# EAGLE board Beilage (EAGLE 9.6.2)
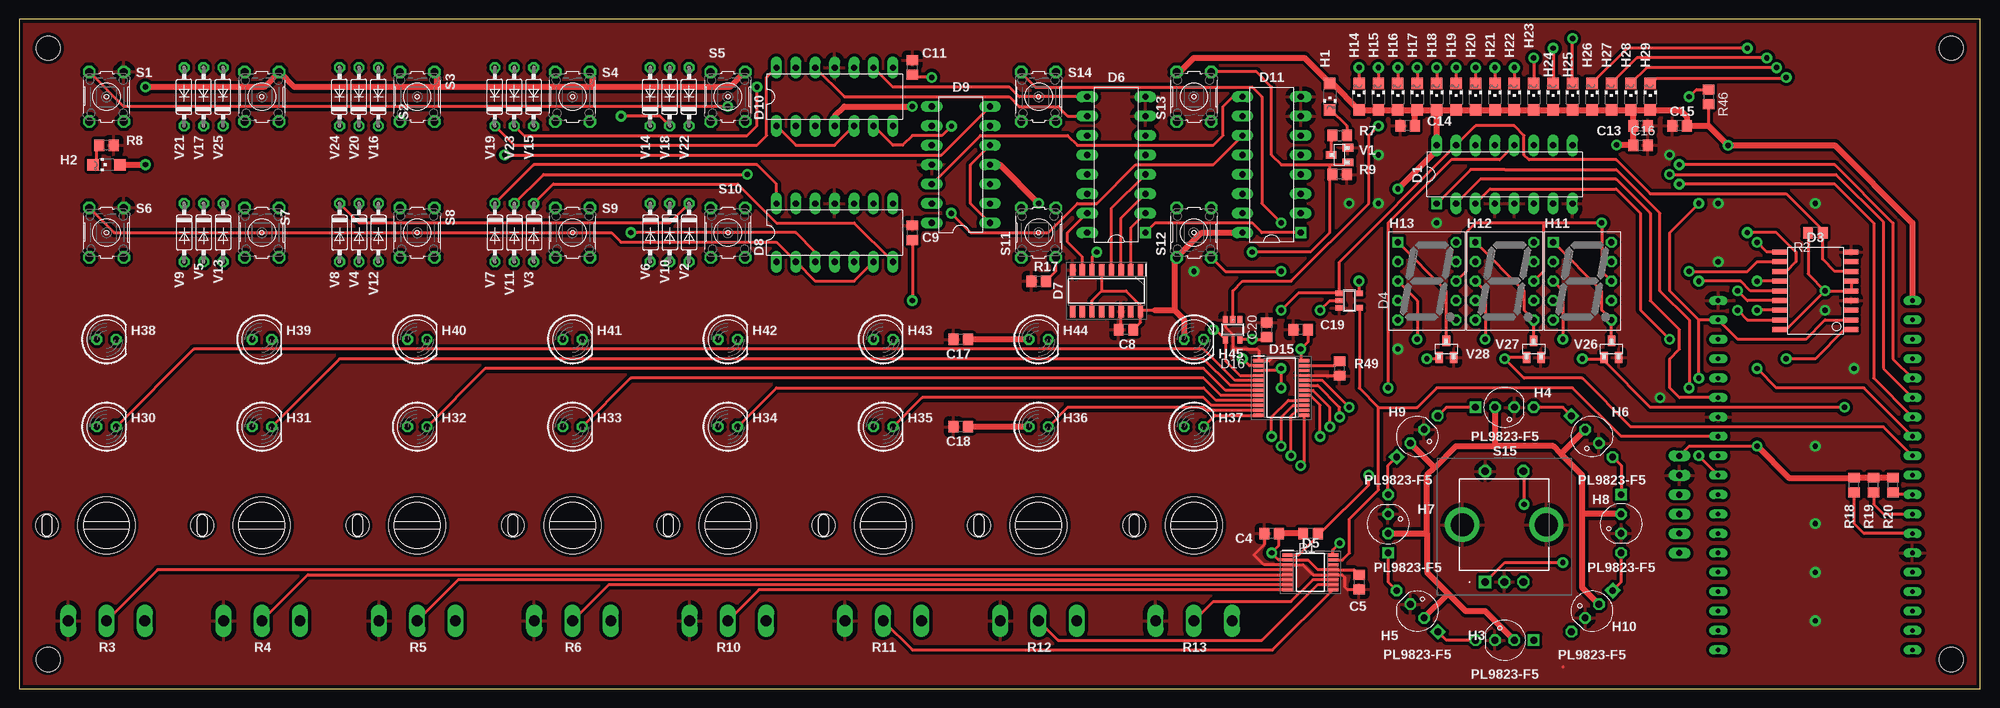
[diagram p5: board, top side]
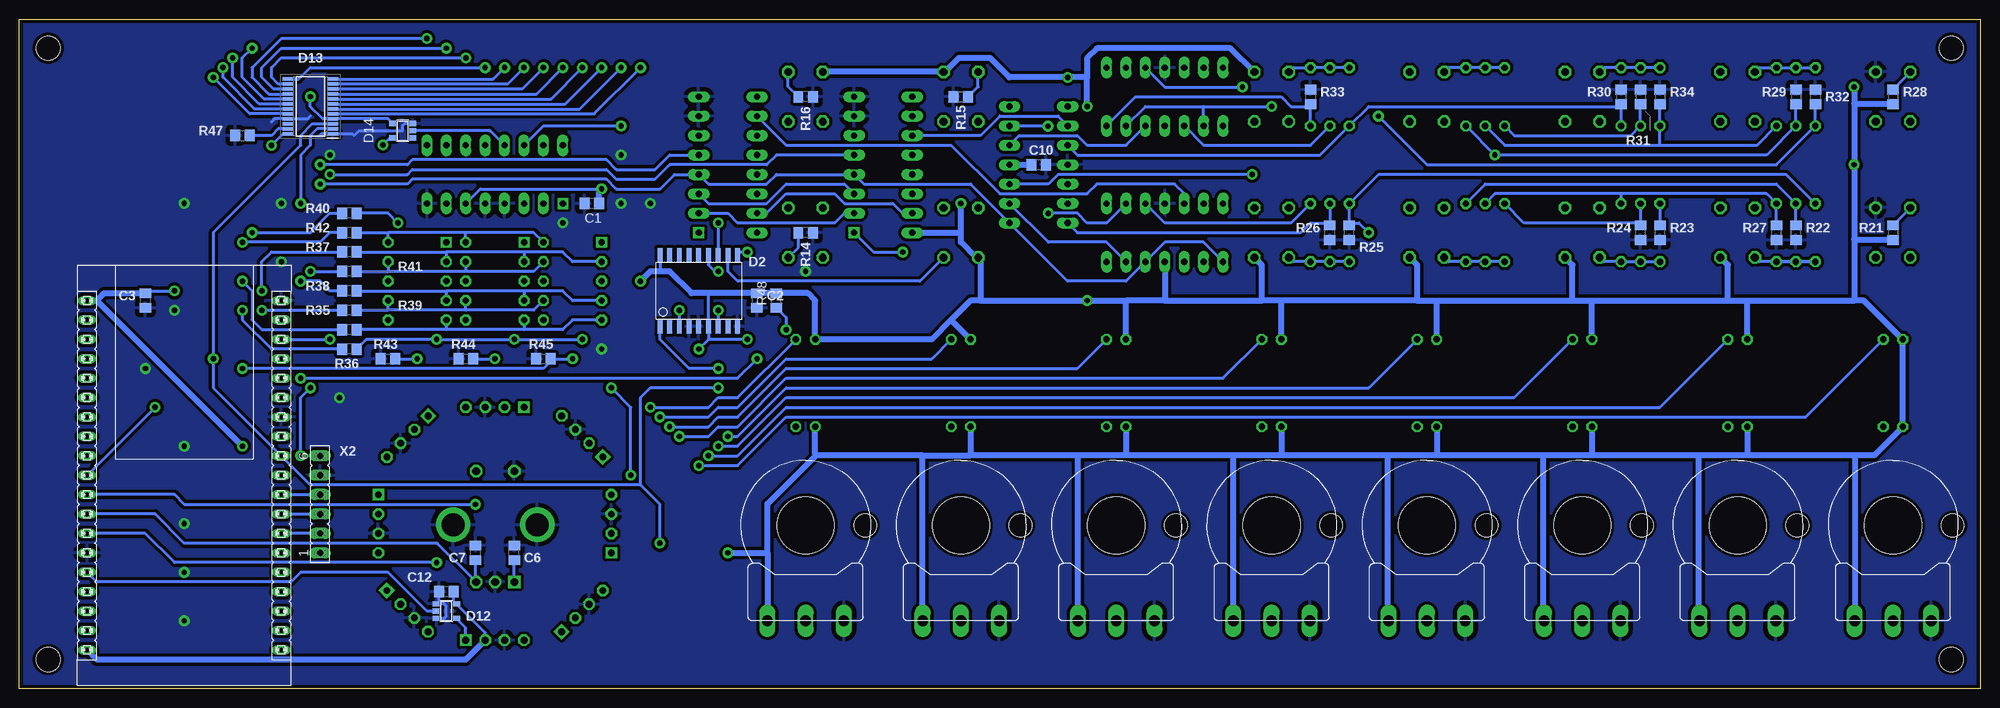
[diagram p6: board, bottom side, seen from below]

Size 256.54 x 87.63 mm. Coordinates in mm from the lower left corner, seen from the top.
Outline: 0,0 256.54,0 256.54,87.63 0,87.63 0,0
Copper layers (1+16): Top 0.035mm / dielectric 1.5mm / Bottom 0.035mm
Design rules "HTL_SMD_V1": minimum track width 10mil, minimum drill 0.5mm, track to track 8mil, track to pad 8mil, pad to pad 8mil, via to via 8mil, smd to smd 8mil, copper to edge 10mil, drill to drill 8mil, minimum pad ring 12mil, minimum via ring 12mil, stop-mask expansion 4mil, vias tented up to drill 20mil, thermal gap 24mil
Holes 3.2 mm at 3.81,3.81 3.81,83.82 252.73,83.82 252.73,3.81

## Footprints (pad centres in the part's own frame; a part is rotated, then mirrored left to right if it is on the bottom)
C0805 = smd 1.3 x 1.5: 1 -0.95,0; 2 0.95,0
DIP16 = drill 0.813 square: 1 -8.89,-3.81 | drill 0.813 long: 2 -6.35,-3.81; 3 -3.81,-3.81; 4 -1.27,-3.81; 5 1.27,-3.81; 6 3.81,-3.81; 7 6.35,-3.81; 8 8.89,-3.81; 9 8.89,3.81; 10 6.35,3.81; 11 3.81,3.81; 12 1.27,3.81; 13 -1.27,3.81; 14 -3.81,3.81; 15 -6.35,3.81; 16 -8.89,3.81
SO18W = smd 1.85 x 0.65: 1 -4.675,5.08; 2 -4.675,3.81; 3 -4.675,2.54; 4 -4.675,1.27; 5 -4.675,0; 6 -4.675,-1.27; 7 -4.675,-2.54; 8 -4.675,-3.81; 9 -4.675,-5.08; 10 4.675,-5.08; 11 4.675,-3.81; 12 4.675,-2.54; 13 4.675,-1.27; 14 4.675,0; 15 4.675,1.27; 16 4.675,2.54; 17 4.675,3.81; 18 4.675,5.08
SOT23-5 = smd 0.69 x 0.99: 1 -0.95,-1.29; 2 0,-1.29; 3 0.95,-1.29; 4 0.95,1.3; 5 -0.95,1.3
TSSOP16 = smd 1.475 x 0.45: 1 -2.938,2.275; 2 -2.938,1.625; 3 -2.938,0.975; 4 -2.938,0.325; 5 -2.938,-0.325; 6 -2.938,-0.975; 7 -2.938,-1.625; 8 -2.938,-2.275; 9 2.938,-2.275; 10 2.938,-1.625; 11 2.938,-0.975; 12 2.938,-0.325; 13 2.938,0.325; 14 2.938,0.975; 15 2.938,1.625; 16 2.938,2.275
SO16 = smd 1.55 x 0.7: 1 -2.725,4.445; 2 -2.725,3.175; 3 -2.725,1.905; 4 -2.725,0.635; 5 -2.725,-0.635; 6 -2.725,-1.905; 7 -2.725,-3.175; 8 -2.725,-4.445; 9 2.725,-4.445; 10 2.725,-3.175; 11 2.725,-1.905; 12 2.725,-0.635; 13 2.725,0.635; 14 2.725,1.905; 15 2.725,3.175; 16 2.725,4.445
DIP14 = drill 0.813 long: 1 -7.62,-3.81; 2 -5.08,-3.81; 3 -2.54,-3.81; 4 0,-3.81; 5 2.54,-3.81; 6 5.08,-3.81; 7 7.62,-3.81; 8 7.62,3.81; 9 5.08,3.81; 10 2.54,3.81; 11 0,3.81; 12 -2.54,3.81; 13 -5.08,3.81; 14 -7.62,3.81
TSSOP24 = smd 1.45 x 0.45: 1 -2.925,3.575; 2 -2.925,2.925; 3 -2.925,2.275; 4 -2.925,1.625; 5 -2.925,0.975; 6 -2.925,0.325; 7 -2.925,-0.325; 8 -2.925,-0.975; 9 -2.925,-1.625; 10 -2.925,-2.275; 11 -2.925,-2.925; 12 -2.925,-3.575; 13 2.925,-3.575; 14 2.925,-2.925; 15 2.925,-2.275; 16 2.925,-1.625; 17 2.925,-0.975; 18 2.925,-0.325; 19 2.925,0.325; 20 2.925,0.975; 21 2.925,1.625; 22 2.925,2.275; 23 2.925,2.925; 24 2.925,3.575
CHIPLED_1206 = smd 1.5 x 1.5: A 0,-1.75; C 0,1.75
LED-PL9823-F5 = drill 0.889 square: 1 -3.81,0 | drill 0.889 octagon: 2 -1.27,0; 3 1.27,0; 4 3.81,0
HDSP-E = drill 0.813 octagon: A 3.81,5.08; B 3.81,2.54; C 3.81,0; CC2 3.81,-5.08; D -3.81,-5.08; DP 3.81,-2.54; E -3.81,-2.54; F -3.81,2.54; G -3.81,0 | drill 0.813 square: CC1 -3.81,5.08
LED5MM = drill 0.813 octagon: A -1.27,0; K 1.27,0
R0805 = smd 1.3 x 1.5: 1 -0.95,0; 2 0.95,0
P160L = drill 1.4 long: 1 -5,0 | drill 1.4 pad 2.1 long: 2 0,0; 3 5,0 | hole 7.5: 0,12.5 | hole 3: -7.8,12.5
B3F-10XX = drill 1.016 octagon: 1 -3.251,2.261; 2 3.251,2.261; 3 -3.251,-2.261; 4 3.251,-2.261
EC11 = drill 1 pad 1.5 square: A1 0,0 | drill 1 pad 1.5 octagon: B1 5,0; C1 2.5,0; D1 0,14.5; E1 5,14.5 | drill 3 pad 4.5: MH1 -3,7.5; MH2 8,7.5
SOT23 = smd 1 x 1.4: 1 -0.95,-1.1; 2 0.95,-1.1; 3 0,1.1
DO35-7 = drill 0.813 octagon: A 3.81,0; C -3.81,0
ESP32-AZDEL = drill 0.6 long: 1 0,0; 2 0,-2.54; 3 0,-5.08; 4 0,-7.62; 5 0,-10.16; 6 0,-12.7; 7 0,-15.24; 8 0,-17.78; 9 0,-20.32; 10 0,-22.86; 11 0,-25.4; 12 0,-27.94; 13 0,-30.48; 14 0,-33.02; 15 0,-35.56; 16 0,-38.1; 17 0,-40.64; 18 0,-43.18; 19 0,-45.72; 20 25.4,-45.72; 21 25.4,-43.18; 22 25.4,-40.64; 23 25.4,-38.1; 24 25.4,-35.56; 25 25.4,-33.02; 26 25.4,-30.48; 27 25.4,-27.94; 28 25.4,-25.4; 29 25.4,-22.86; 30 25.4,-20.32; 31 25.4,-17.78; 32 25.4,-15.24; 33 25.4,-12.7; 34 25.4,-10.16; 35 25.4,-7.62; 36 25.4,-5.08; 37 25.4,-2.54; 38 25.4,0
FE06 = drill 0.813 long: 1 -6.35,0; 2 -3.81,0; 3 -1.27,0; 4 1.27,0; 5 3.81,0; 6 6.35,0

## Placement (x,y rotation side)
C1  1u  [C0805]  181.61,63.5 180 bottom
C2  1u  [C0805]  160.02,50.8 270 bottom
C3  1u  [C0805]  240.03,50.8 270 bottom
C4  100n  [C0805]  163.83,20.32 180 top
C5  100n  [C0805]  175.26,13.97 270 top
C6  10n  [C0805]  191.77,17.78 90 bottom
C7  10n  [C0805]  196.85,17.78 90 bottom
C8  1u  [C0805]  144.78,46.99 180 top
C9  1u  [C0805]  116.84,59.69 90 top
C10  1u  [C0805]  123.19,68.58 0 bottom
C11  1u  [C0805]  116.84,81.28 90 top
C12  100n  [C0805]  200.66,12.7 180 bottom
C13  1u  [C0805]  212.09,73.66 0 top
C14  1u  [C0805]  181.61,73.66 180 top
C15  100n  [C0805]  217.17,73.66 180 top
C16  100n  [C0805]  212.09,71.12 0 top
C17  1u  [C0805]  123.19,45.72 180 top
C18  1u  [C0805]  123.19,34.29 180 top
C19  100n  [C0805]  167.64,46.99 180 top
C20  100n  [C0805]  163.19,46.99 90 top
D1  74AHC138N  [DIP16]  194.31,67.31 0 top
D2  MCP23S08SO  [SO18W]  167.64,52.07 90 bottom
D3  MCP23S08SO  [SO18W]  234.95,52.07 180 top
D4  74AHC1G125DBV  [SOT23-5]  173.99,50.8 270 top
D5  ADC088S052  [TSSOP16]  168.91,15.24 0 top
D6  74HC151N  [DIP16]  143.51,68.58 90 top
D7  74HC193D  [SO16]  142.24,52.07 270 top
D8  74HC73N  [DIP14]  106.68,59.69 0 top
D9  74HC73N  [DIP14]  123.19,68.58 90 top
D10  74HC73N  [DIP14]  106.68,77.47 0 top
D11  74HC151N  [DIP16]  163.83,68.58 90 top
D12  74AHCT1G125DBV  [SOT23-5]  200.66,10.16 270 bottom
D13  STP16CP05TTR  [TSSOP24]  218.44,76.2 180 bottom
D14  74AHC1G04DBV  [SOT23-5]  206.38,73.03 90 bottom
D15  STP16CP05TTR  [TSSOP24]  165.1,39.37 0 top
D16  74AHC1G04DBV  [SOT23-5]  158.75,46.99 180 top
H1  bl  [CHIPLED_1206]  171.45,77.47 180 top
H2  gn  [CHIPLED_1206]  11.43,68.58 90 top
H3  PL9823-F5  [LED-PL9823-F5]  194.31,6.35 180 top
H4  PL9823-F5  [LED-PL9823-F5]  194.31,36.83 0 top
H5  PL9823-F5  [LED-PL9823-F5]  182.88,10.16 135 top
H6  PL9823-F5  [LED-PL9823-F5]  205.74,33.02 315 top
H7  PL9823-F5  [LED-PL9823-F5]  179.07,21.59 90 top
H8  PL9823-F5  [LED-PL9823-F5]  209.55,21.59 270 top
H9  PL9823-F5  [LED-PL9823-F5]  182.88,33.02 45 top
H10  PL9823-F5  [LED-PL9823-F5]  205.74,10.16 225 top
H11  [HDSP-E]  204.47,53.34 0 top
H12  [HDSP-E]  194.31,53.34 0 top
H13  [HDSP-E]  184.15,53.34 0 top
H14  rt  [CHIPLED_1206]  175.26,77.47 0 top
H15  rt  [CHIPLED_1206]  177.8,77.47 0 top
H16  rt  [CHIPLED_1206]  180.34,77.47 0 top
H17  rt  [CHIPLED_1206]  182.88,77.47 0 top
H18  rt  [CHIPLED_1206]  185.42,77.47 0 top
H19  rt  [CHIPLED_1206]  187.96,77.47 0 top
H20  rt  [CHIPLED_1206]  190.5,77.47 0 top
H21  rt  [CHIPLED_1206]  193.04,77.47 0 top
H22  rt  [CHIPLED_1206]  195.58,77.47 0 top
H23  rt  [CHIPLED_1206]  198.12,77.47 0 top
H24  rt  [CHIPLED_1206]  200.66,77.47 0 top
H25  rt  [CHIPLED_1206]  203.2,77.47 0 top
H26  rt  [CHIPLED_1206]  205.74,77.47 0 top
H27  rt  [CHIPLED_1206]  208.28,77.47 0 top
H28  rt  [CHIPLED_1206]  210.82,77.47 0 top
H29  rt  [CHIPLED_1206]  213.36,77.47 0 top
H30  gn  [LED5MM]  11.43,34.29 0 top
H31  gn  [LED5MM]  31.75,34.29 0 top
H32  gn  [LED5MM]  52.07,34.29 0 top
H33  gn  [LED5MM]  72.39,34.29 0 top
H34  gn  [LED5MM]  92.71,34.29 0 top
H35  gn  [LED5MM]  113.03,34.29 0 top
H36  gn  [LED5MM]  133.35,34.29 0 top
H37  gn  [LED5MM]  153.67,34.29 0 top
H38  ge  [LED5MM]  11.43,45.72 0 top
H39  ge  [LED5MM]  31.75,45.72 0 top
H40  ge  [LED5MM]  52.07,45.72 0 top
H41  ge  [LED5MM]  72.39,45.72 0 top
H42  ge  [LED5MM]  92.71,45.72 0 top
H43  ge  [LED5MM]  113.03,45.72 0 top
H44  ge  [LED5MM]  133.35,45.72 0 top
H45  ge  [LED5MM]  153.67,45.72 0 top
R1  10k  [R0805]  168.91,20.32 180 top
R2  10k  [R0805]  234.95,59.69 180 top
R3  10k  [P160L]  11.43,8.89 0 top
R4  10k  [P160L]  31.75,8.89 0 top
R5  10k  [P160L]  52.07,8.89 0 top
R6  10k  [P160L]  72.39,8.89 0 top
R7  330R  [R0805]  172.72,72.39 0 top
R8  330R  [R0805]  11.43,71.12 180 top
R9  1M  [R0805]  172.72,67.31 180 top
R10  10k  [P160L]  92.71,8.89 0 top
R11  10k  [P160L]  113.03,8.89 0 top
R12  10k  [P160L]  133.35,8.89 0 top
R13  10k  [P160L]  153.67,8.89 0 top
R14  56k  [R0805]  153.67,59.69 180 bottom
R15  56k  [R0805]  133.35,77.47 0 bottom
R16  56k  [R0805]  153.67,77.47 180 bottom
R17  56k  [R0805]  133.35,53.34 0 top
R18  56k  [R0805]  240.03,26.67 90 top
R19  56k  [R0805]  242.57,26.67 90 top
R20  56k  [R0805]  245.11,26.67 90 top
R21  100k  [R0805]  11.43,59.69 270 bottom
R22  100k  [R0805]  24.13,59.69 90 bottom
R23  100k  [R0805]  41.91,59.69 90 bottom
R24  100k  [R0805]  44.45,59.69 90 bottom
R25  100k  [R0805]  82.55,59.69 90 bottom
R26  100k  [R0805]  85.09,59.69 90 bottom
R27  100k  [R0805]  26.67,59.69 90 bottom
R28  100k  [R0805]  11.43,77.47 270 bottom
R29  100k  [R0805]  24.13,77.47 270 bottom
R30  100k  [R0805]  46.99,77.47 270 bottom
R31  100k  [R0805]  44.45,77.47 270 bottom
R32  100k  [R0805]  21.59,77.47 270 bottom
R33  100k  [R0805]  87.63,77.47 270 bottom
R34  100k  [R0805]  41.91,77.47 270 bottom
R35  100R  [R0805]  213.36,49.53 180 bottom
R36  100R  [R0805]  213.36,44.45 180 bottom
R37  100R  [R0805]  213.36,57.15 180 bottom
R38  100R  [R0805]  213.36,52.07 180 bottom
R39  100R  [R0805]  213.36,46.99 180 bottom
R40  100R  [R0805]  213.36,62.23 180 bottom
R41  100R  [R0805]  213.36,54.61 180 bottom
R42  100R  [R0805]  213.36,59.69 180 bottom
R43  100k  [R0805]  208.28,43.18 0 bottom
R44  100k  [R0805]  198.12,43.18 0 bottom
R45  100k  [R0805]  187.96,43.18 0 bottom
R46  10k  [R0805]  220.98,77.47 270 top
R47  2k7  [R0805]  227.33,72.39 0 bottom
R48  10k  [R0805]  157.48,50.8 90 bottom
R49  2k7  [R0805]  172.72,41.91 90 top
S1  [B3F-10XX]  11.43,77.47 270 top
S2  [B3F-10XX]  31.75,77.47 270 top
S3  [B3F-10XX]  52.07,77.47 270 top
S4  [B3F-10XX]  72.39,77.47 270 top
S5  [B3F-10XX]  92.71,77.47 270 top
S6  [B3F-10XX]  11.43,59.69 270 top
S7  [B3F-10XX]  31.75,59.69 270 top
S8  [B3F-10XX]  52.07,59.69 270 top
S9  [B3F-10XX]  72.39,59.69 270 top
S10  [B3F-10XX]  92.71,59.69 270 top
S11  [B3F-10XX]  133.35,59.69 90 top
S12  [B3F-10XX]  153.67,59.69 90 top
S13  [B3F-10XX]  153.67,77.47 90 top
S14  [B3F-10XX]  133.35,77.47 270 top
S15  EC11E09244AQ  [EC11]  191.77,13.97 0 top
V1  NTR4003  [SOT23]  172.72,69.85 90 top
V2  1N4148-7  [DO35-7]  87.63,59.69 270 top
V3  1N4148-7  [DO35-7]  67.31,59.69 270 top
V4  1N4148-7  [DO35-7]  41.91,59.69 270 top
V5  1N4148-7  [DO35-7]  24.13,59.69 270 top
V6  1N4148-7  [DO35-7]  82.55,59.69 270 top
V7  1N4148-7  [DO35-7]  62.23,59.69 270 top
V8  1N4148-7  [DO35-7]  44.45,59.69 270 top
V9  1N4148-7  [DO35-7]  21.59,59.69 270 top
V10  1N4148-7  [DO35-7]  85.09,59.69 270 top
V11  1N4148-7  [DO35-7]  64.77,59.69 270 top
V12  1N4148-7  [DO35-7]  46.99,59.69 270 top
V13  1N4148-7  [DO35-7]  26.67,59.69 270 top
V14  1N4148-7  [DO35-7]  82.55,77.47 90 top
V15  1N4148-7  [DO35-7]  67.31,77.47 90 top
V16  1N4148-7  [DO35-7]  46.99,77.47 90 top
V17  1N4148-7  [DO35-7]  24.13,77.47 90 top
V18  1N4148-7  [DO35-7]  85.09,77.47 90 top
V19  1N4148-7  [DO35-7]  62.23,77.47 90 top
V20  1N4148-7  [DO35-7]  44.45,77.47 90 top
V21  1N4148-7  [DO35-7]  21.59,77.47 90 top
V22  1N4148-7  [DO35-7]  87.63,77.47 90 top
V23  1N4148-7  [DO35-7]  64.77,77.47 90 top
V24  1N4148-7  [DO35-7]  41.91,77.47 90 top
V25  1N4148-7  [DO35-7]  26.67,77.47 90 top
V26  NTR4003  [SOT23]  208.28,44.45 0 top
V27  NTR4003  [SOT23]  198.12,44.45 0 top
V28  NTR4003  [SOT23]  186.69,44.45 0 top
X1  ESP32-AZDEL  [ESP32-AZDEL]  247.65,50.8 0 bottom
X2  [FE06]  217.17,24.13 90 bottom

## Tracks (layer width: path | path; a pad name or v marks a point on that pad's centre or on a via)
7SEG_A  (via drill 0.7 pad 1.4)
  Top 0.406: D3.10 228.6,57.15 v227.33,58.42
  Bottom 0.406: R42.2 215.9,59.69 217.17,58.42 v227.33,58.42
7SEG_B  (via drill 0.7 pad 1.4)
  Top 0.406: D3.11 227.33,55.88 226.06,54.61 v218.44,54.61
  Bottom 0.406: v218.44,54.61 R41.2
7SEG_C  (via drill 0.7 pad 1.4)
  Top 0.406: v226.06,59.69 229.87,59.69 232.41,57.15 232.41,55.88 231.14,54.61 D3.12
  Bottom 0.406: R40.2 215.9,62.23 218.44,59.69 v226.06,59.69
7SEG_CE  (via drill 0.7 pad 1.4)
  Top 0.406: V28.1 185.74,43.18 v184.15,43.18 | v227.33,41.91 229.87,39.37 241.3,39.37 X1.8
  Bottom 0.406: v184.15,43.18 R45.2 187.01,42.86 187.96,41.91 v227.33,41.91
7SEG_CH  (via drill 0.7 pad 1.4)
  Top 0.406: v238.76,36.83 213.36,36.83 207.33,42.86 V26.1 207.16,43.18 v204.47,43.18
  Bottom 0.406: R43.2 v204.47,43.18 | X1.10 v238.76,36.83
7SEG_CZ  (via drill 0.7 pad 1.4)
  Top 0.406: V27.1 194.48,43.35 v194.31,43.18 196.85,40.64 204.47,40.64 210.82,34.29 243.84,34.29 X1.9
  Bottom 0.406: R44.2 v194.31,43.18
7SEG_D  (via drill 0.7 pad 1.4)
  Top 0.406: D3.13 v227.33,53.34
  Bottom 0.406: v227.33,53.34 226.06,52.07 226.06,48.26 224.79,46.99 R39.2
7SEG_DP  (via drill 0.7 pad 1.4)
  Top 0.406: v224.79,49.53 226.06,48.26 D3.17
  Bottom 0.406: v224.79,49.53 R35.2
7SEG_E  (via drill 0.7 pad 1.4)
  Top 0.406: D3.14 226.47,52.07 225.19,53.34 v219.71,53.34
  Bottom 0.406: R38.2 215.9,52.07 217.17,53.34 v219.71,53.34
7SEG_F  (via drill 0.7 pad 1.4)
  Top 0.406: D3.15 226.06,50.8 v224.79,52.07
  Bottom 0.406: R37.2 223.52,57.15 224.79,55.88 v224.79,52.07
7SEG_G  (via drill 0.7 pad 1.4)
  Top 0.406: D3.16 v227.33,49.53
  Bottom 0.406: R36.2 223.52,44.45 227.33,48.26 v227.33,49.53
23S08_!CS  (via drill 0.7 pad 1.4)
  Top 0.406: v165.1,49.53 167.32,51.75 D4.1 172.7,55.86 D1.15 190.5,73.66 195.58,73.66 196.85,72.39 196.85,69.85 197.49,69.22 208.91,69.22 213.36,64.77 231.14,64.77 235.9,60.01 R2.1 235.9,56.2 237.49,54.61 D3.7
  Bottom 0.406: v165.1,49.53 D2.7
088S052_!CS!  (via drill 0.7 pad 1.4)
  Top 0.406: D1.12 193.68,69.22 187.32,69.22 179.07,60.96 v179.07,39.37 | v176.53,27.94 176.53,26.67 170.18,20.32 R1.1 169.86,20 167.38,17.52 D5.1
  Bottom 0.406: v179.07,39.37 176.53,36.83 v176.53,27.94
!CS!_A  (via drill 0.7 pad 1.4)
  Top 0.406: v218.44,39.37 218.44,48.26 214.63,52.07 214.63,62.23 208.91,67.94 194.31,67.94 189.87,67.94 D1.1 | X1.29 v219.71,30.48
  Bottom 0.406: v219.71,30.48 219.71,38.1 v218.44,39.37
!CS!_B
  Top 0.406: D1.2 191.13,66.67 208.91,66.67 213.36,62.23 213.36,50.8 217.17,46.99 217.17,44.45 215.9,43.18 215.9,39.37 217.17,38.1 X1.33
!CS!_C  (via drill 0.7 pad 1.4)
  Top 0.406: D1.3 192.41,65.41 208.91,65.41 212.09,62.23 212.09,49.53 v215.9,45.72
  Bottom 0.406: X1.36 v215.9,45.72
+3V3  (via drill 0.7 pad 1.4)
  Top 0.406: D7.11 140.34,50.8 141.6,52.07 | 141.6,52.07 144.78,52.07 146.69,50.16 D7.16 | D7.5 141.6,52.07 | D7.16 146.87,49.53 148.59,49.53 | D3.18 231.14,46.99 v236.22,52.07 | C9.1 v116.84,50.8 | v119.38,80.01 117.16,80.01 C11.1 | C8.1 146.69,47.95 D7.16 | v236.22,52.07 D3.5 D3.6 | C4.1 164.78,18.73 v163.83,17.78 164.75,16.86 D5.2 168.56,16.86 169.85,15.56 D5.13 174.62,15.56 C5.1 | X2.6 218.44,31.75 v227.33,31.75 | D15.24 167.64,42.95 v167.64,44.45 168.59,45.4 C19.1 | v175.26,53.34 175.26,51.78 D4.5 | R2.2 234,54.29 v236.22,52.07 | R46.2 220.98,73.66 | D16.5 159.73,45.72 v161.29,45.72 162.88,45.72 C20.1
  Top 0.813: D10.4 106.68,74.93 107.95,76.2 v116.84,76.2 | v133.35,63.5 128.27,68.58 D9.4 | S5.1 92.99,78.74 74.93,78.74 | 74.93,78.74 54.61,78.74 | 54.61,78.74 35.99,78.74 S2.1 32.03,78.74 v16.51,78.74 | S4.1 74.93,80.44 74.93,78.74 | S3.1 54.61,80.44 54.61,78.74 | S13.2 151.84,80.72 153.67,82.55 168.12,82.55 H1.A 171.76,79.22 H14.A H15.A H16.A H17.A | H17.A H18.A | H18.A H19.A H20.A H21.A H22.A H23.A H24.A H25.A H26.A H27.A H28.A | H28.A H29.A 217.27,75.72 218.12,74.87 C15.1 220.98,73.66 v223.52,71.12 237.49,71.12 247.65,60.96 X1.1 | 151.13,49.53 151.13,56.16 S12.1 154.66,59.69 D11.16 | 148.59,49.53 151.13,49.53 | v227.33,31.75 231.46,27.62 R18.2 R19.2 R20.2 | H18.A D1.16 185.42,70.48 v180.34,65.41 | H36.A C18.1 | H44.A C17.1 | C14.1 182.56,75.4 H17.A | H2.A v16.51,68.58 | R1.2 C4.1 | 151.13,49.53 152.4,48.26 H45.A | v208.96,71.17 209,71.12 C16.1 C13.1 211.14,75.4 H28.A
  Bottom 0.406: v223.52,71.12 222.01,72.62 D13.24 | C3.1 239.71,52.07 v236.22,52.07 | 166.37,51.75 D2.6 166.37,45.72 | D1.6 196.22,65.41 v180.34,65.41 | D2.18 172.72,54.61 | v208.96,71.17 208.05,72.08 D14.5 | v161.29,45.72 166.37,45.72 | v167.64,44.45 166.37,45.72
  Bottom 0.813: D8.4 106.68,50.8 | 106.68,50.8 93.98,50.8 | 73.66,50.8 91.44,50.8 | 91.44,50.8 93.98,50.8 | 73.66,50.8 71.12,50.8 | 71.12,50.8 53.34,50.8 | 53.34,50.8 50.8,50.8 | 50.8,50.8 33.02,50.8 | 106.68,50.8 111.76,50.8 | 53.34,50.8 53.34,55.45 S8.2 | 73.66,50.8 73.66,55.45 S9.2 | 33.02,50.8 33.02,55.45 S7.2 | 93.98,50.8 93.98,55.45 S10.2 | 16.43,30.56 R3.3 | 16.43,30.56 30.48,30.56 | 30.48,30.56 36.83,30.56 | 36.83,30.56 50.8,30.56 | 50.8,30.56 57.15,30.56 | 57.15,30.56 71.12,30.56 | 71.12,30.56 77.47,30.56 | 77.47,30.56 91.44,30.56 | 91.44,30.56 97.79,30.56 | 97.79,30.56 111.76,30.56 | 111.76,30.56 118.11,30.56 | R4.3 36.83,8.97 36.83,30.56 | R5.3 57.15,8.97 57.15,30.56 | R6.3 77.47,8.97 77.47,30.56 | R10.3 97.71,30.48 97.79,30.56 | R11.3 118.03,30.48 118.11,30.56 | 158.67,17.78 158.67,24.21 152.32,30.56 | 158.67,17.78 R13.3 | 118.11,30.56 132.08,30.56 | 138.43,30.56 132.08,30.56 | 138.43,30.56 152.32,30.56 | R12.3 138.35,30.48 138.43,30.56 | 33.02,50.8 30.48,50.8 | 30.48,50.8 16.51,50.8 | S13.2 S14.1 135.46,80.72 133.63,82.55 129.54,82.55 127,80.01 v119.38,80.01 116.84,80.01 | 133.35,59.69 133.35,58.42 131.37,56.44 S11.1 130.81,56.16 130.81,50.8 | 133.35,59.69 v133.35,63.5 | S5.1 98.07,83.82 115.57,83.82 116.84,82.55 116.84,80.01 | v16.51,78.74 16.51,76.58 | 16.51,76.58 v16.51,68.58 16.51,58.8 | 16.51,58.8 16.51,50.8 | D6.16 133.35,59.69 | H39.A 30.48,50.8 | 16.51,50.8 15.24,50.8 H38.A H30.A 13.89,30.56 16.43,30.56 | H31.A 30.48,30.56 | H32.A 50.8,30.56 | H33.A 71.12,30.56 | H40.A 50.8,50.8 | H36.A 132.08,30.56 | H35.A 111.76,30.56 | H34.A 91.44,30.56 | H41.A 71.12,50.8 | H42.A 91.44,50.8 | H43.A 111.76,50.8 | 130.81,50.8 132.08,50.8 134.62,48.26 | 130.81,50.8 v116.84,50.8 111.76,50.8
  Bottom 0.813: 152.32,30.56 152.4,30.64 H37.A | R28.2 16.45,76.52 16.51,76.58 | v163.83,17.78 158.67,17.78 | R21.2 16.45,58.74 16.51,58.8 | v116.84,76.2 116.84,80.01 | v227.33,31.75 246.38,50.8 | 246.38,50.8 245.43,51.75 C3.1 | D9.4 C10.1 | X1.1 246.38,50.8 | C1.1 180.66,65.08 v180.34,65.41 | v175.26,53.34 173.99,54.61 172.72,54.61 171.45,54.61 168.59,51.75 166.37,51.75 C2.1 R48.2 153.35,51.75 152.4,50.8 H45.A 137.16,45.72 134.62,48.26 | H44.A 134.62,48.26
+5V
  Top 0.813: 193.04,31.75 200.66,31.75 201.68,30.73 | 184.15,20.32 184.15,15.24 186.94,12.45 | 186.94,12.45 189.23,10.16 191.77,10.16 H3.2 | H10.2 204.47,13.23 204.47,22.86 | 204.47,22.86 204.47,27.94 201.68,30.73 | H7.2 184.15,20.32 | H4.2 193.04,31.75 | H8.2 204.47,22.86 | H5.2 186.94,12.43 186.94,12.45 | 184.15,20.32 184.15,27.96 185.16,28.96 | 193.04,31.75 187.94,31.75 185.16,28.96 | H9.2 185.14,28.96 185.16,28.96 | H6.2 201.68,30.75 201.68,30.73
  Bottom 0.406: C12.1 199.71,11.46 D12.5 195.58,7.33 H3.2
  Bottom 0.813: H3.2 198.12,3.81 246.38,3.81 X1.19
ADC0
  Top 0.406: D5.4 18.11,15.56 R3.2
ADC1
  Top 0.406: D5.5 37.77,14.91 R4.2
ADC2
  Top 0.406: D5.6 57.45,14.27 R5.2
ADC3
  Top 0.406: D5.7 77.11,13.62 R6.2
ADC4
  Top 0.406: D5.8 96.78,12.96 R10.2
ADC5
  Top 0.406: R11.2 116.84,5.08 163.96,5.08 D5.9
ADC6
  Top 0.406: D5.10 169.82,13.62 162.56,6.35 135.89,6.35 R12.2
ADC7
  Top 0.406: D5.11 169.21,14.27 166.37,11.43 156.21,11.43 R13.2
BCK
  Bottom 0.406: X2.2 X1.26
BPM_DIV_Q0
  Bottom 0.406: D6.11 130.81,72.39 128.27,74.93 120.65,74.93 D9.9
BPM_DIV_Q1
  Top 0.406: D10.12 107.95,77.47 129.54,77.47 130.81,76.2 135.89,76.2 137.16,74.93 D6.10
BPM_DIV_Q2
  Top 0.406: D6.9 130.81,77.47 129.54,78.74 114.3,78.74 D10.9
CLRR
  Top 0.406: R17.2 135.61,54.65 S11.3
  Bottom 0.406: S11.3 138.71,53.34 162.56,53.34 163.83,54.61 D2.11
DOUT
  Bottom 0.406: X1.27 X2.3
EC11_A  (via drill 0.7 pad 1.4)
  Top 0.406: R18.1 240.03,21.59 241.3,20.32 X1.13 | S15.A1 194.31,16.51 v201.93,16.51
  Bottom 0.406: v201.93,16.51 236.22,16.51 240.03,20.32 X1.13 | S15.A1 C6.1
EC11_B
  Top 0.406: R19.1 242.57,24.13 243.84,22.86 X1.12
  Bottom 0.406: C7.1 196.85,14.05 S15.B1 201.85,19.05 234.95,19.05 238.76,22.86 X1.12
EC11_SW  (via drill 0.7 pad 1.4)
  Top 0.406: S15.E1 196.85,28.39 v196.85,24.13 | X1.11 245.43,25.4 R20.1
  Bottom 0.406: v196.85,24.13 234.95,24.13 236.22,25.4 X1.11
EVENT  (via drill 0.7 pad 1.4)
  Top 0.406: S13.4 161.85,80.72 163.83,78.74 163.83,69.85 165.1,68.58 171.45,68.58 | 171.45,68.58 173.5,68.58 V1.1 | v161.29,57.15 168.91,57.15 171.45,59.69 171.45,66.99 R9.2 171.45,67.63 171.45,68.58
  Bottom 0.406: R16.2 155.93,78.78 S13.4 | D2.10 162.16,57.15 v161.29,57.15
GATE_DIV_Q0  (via drill 0.7 pad 1.4)
  Top 0.406: D11.11 156.21,68.58 146.05,68.58 140.97,63.5 138.43,63.5 134.62,59.69 124.46,59.69 v121.92,62.23
  Bottom 0.406: D8.9 114.3,60.96 116.84,60.96 118.11,62.23 v121.92,62.23
GATE_DIV_Q1
  Bottom 0.406: D8.12 104.14,64.77 105.41,66.04 115.57,66.04 116.84,64.77 128.27,64.77 134.62,71.12 156.21,71.12 D11.10
GATE_DIV_Q2
  Top 0.406: D11.9 158.75,77.47 157.48,76.2 157.48,72.39 156.21,71.12 138.43,71.12 137.16,72.39 125.73,72.39 D9.12
GND  (via drill 0.7 pad 1.4)
  Top 0.406: 201.99,2.86 201.93,2.92 | C8.2 144.15,47.3 D7.14 | C5.2 173.67,13.02 173.35,13.34 173.35,14.61 173.04,14.91 D5.12 169.24,14.91 167.94,16.21 D5.3 162.85,16.21 161.54,17.53 162.88,18.86 C4.2 | D15.21 172.69,40.99 R49.1 | 163.83,43.18 163.59,42.95 D15.1 162.18,44.2 161.93,44.45 158.75,44.45 158.75,46.35 157.8,47.3 157.8,47.31 D16.3
  Bottom 0.406: 218.44,74.93 218.79,74.58 D13.21 223.11,74.58 223.52,74.17 | 217.17,72.39 216.94,72.62 D13.1 212.96,72.62 212.72,72.39 212.09,73.03 206.38,73.03 206.38,73.66 206.06,73.97 D14.3 | C12.2 201.61,11.45 D12.1 200.97,11.11 200.66,10.79 200.66,9.53 200.97,9.21 D12.3
  other vias: 214.63,38.1 234.95,63.5 222.25,55.88 215.9,69.85 222.25,63.5 236.22,49.53 180.34,44.45 177.8,69.85 153.67,54.61 173.99,63.5 185.42,60.96 234.95,31.75 240.03,41.91 234.95,21.59 234.95,15.24 234.95,8.89 177.8,63.5
  pour Top (isolate 0.406): 0,87.63 256.54,87.63 256.54,0 0,0
  pour Bottom (isolate 0.406): 0,87.63 256.54,87.63 256.54,0 0,0
LCK
  Bottom 0.406: X1.28 X2.4
MISO
  Top 0.406: D5.15 173.12,16.86 174.01,17.76 174.01,22.25 177.8,26.04 177.8,36.83 | X1.31 209.55,33.02 203.2,39.37 185.42,39.37 182.88,36.83 177.8,36.83 | D4.4 175.29,39.34 177.8,36.83
MOSI  (via drill 0.7 pad 1.4)
  Top 0.406: D3.2 236.22,48.26 233.68,45.72 224.79,45.72 X1.37 219.71,48.26 | v219.71,40.64 219.71,48.26 | 219.71,48.26 215.9,52.07 215.9,59.69 v219.71,63.5 | v160.02,43.18 160.91,42.3 D15.2
  Bottom 0.406: v160.02,43.18 162.56,40.64 v219.71,40.64 | D13.2 217.56,73.28 218.44,72.39 218.44,71.12 219.71,69.85 v219.71,63.5
N$1
  Bottom 0.406: D9.14 118.11,59.69 88.9,59.69 87.63,60.96 85.41,60.96 R26.2 V10.C
N$2
  Top 0.406: V2.C 85.09,60.96 44.45,60.96 V4.C
  Bottom 0.406: V4.C R23.2 | V2.C 90.17,60.96 106.68,60.96 D8.10
N$3
  Top 0.406: V7.C 67.31,68.58 96.52,68.58 99.06,66.04 D8.14
  Bottom 0.406: V8.C R24.2 44.77,60.96 59.69,60.96 V7.C
N$4
  Top 0.406: H4.1 186.69,36.83 H9.4
N$5
  Top 0.406: V3.C 69.85,66.04 93.98,66.04 99.06,60.96 109.22,60.96 D8.7
  Bottom 0.406: R22.2 V5.C 26.67,66.04 64.77,66.04 V3.C
N$6  (via drill 0.7 pad 1.4)
  Top 0.406: V11.C 68.58,67.31 v95.25,67.31
  Bottom 0.406: 46.99,64.77 27.94,64.77 V13.C R27.2 | 46.99,64.77 63.5,64.77 V11.C | V12.C 46.99,64.77 | v95.25,67.31 120.65,67.31 121.92,66.04 D9.3
N$7
  Bottom 0.406: H13.DP 189.23,49.53 198.12,49.53 | 198.12,49.53 H12.DP | 198.12,49.53 208.28,49.53 | 208.28,49.53 H11.DP | R35.1 208.28,49.53
N$8
  Bottom 0.406: H3.1 198.12,7.97 D12.4
N$9
  Top 0.406: H2.C 10.16,69.06 10.16,70.8 R8.2
N$10  (via drill 0.7 pad 1.4)
  Top 0.406: v175.26,81.28 H14.C
  Bottom 0.406: D13.5 181.31,75.22 v175.26,81.28
N$11  (via drill 0.7 pad 1.4)
  Top 0.406: v177.8,81.28 H15.C
  Bottom 0.406: D13.6 183.21,75.88 v177.8,81.28
N$12  (via drill 0.7 pad 1.4)
  Top 0.406: v180.34,81.28 H16.C
  Bottom 0.406: D13.7 185.09,76.53 v180.34,81.28
N$13  (via drill 0.7 pad 1.4)
  Top 0.406: v182.88,81.28 H17.C
  Bottom 0.406: D13.8 186.99,77.17 v182.88,81.28
N$14  (via drill 0.7 pad 1.4)
  Top 0.406: D8.3 104.14,57.15 101.6,59.69 v80.01,59.69
  Bottom 0.406: V9.C 25.4,67.31 78.74,67.31 V6.C R25.2 82.23,60.96 81.28,60.96 v80.01,59.69
N$15
  Bottom 0.406: V16.C R30.2 47.31,76.2 80.01,76.2 V14.C 86.36,69.85 118.11,69.85 D9.10
N$16  (via drill 0.7 pad 1.4)
  Top 0.406: V23.C 66.04,72.39 95.25,72.39 96.52,73.66 v96.52,78.74
  Bottom 0.406: R34.2 V24.C 41.91,71.12 | V23.C 62.23,71.12 41.91,71.12 | 41.91,71.12 29.21,71.12 V25.C | D10.10 106.68,78.74 v96.52,78.74
N$17
  Bottom 0.406: V22.C R33.2 87.95,76.2 90.17,76.2 91.44,77.47 110.49,77.47 D10.7
N$18
  Top 0.406: V19.C 64.77,71.12 96.52,71.12 97.79,72.39 97.79,80.01 D10.14
  Bottom 0.406: R31.2 V20.C 45.72,72.39 60.96,72.39 V19.C
N$19  (via drill 0.7 pad 1.4)
  Top 0.406: v63.5,69.85 120.65,69.85 D9.7
  Bottom 0.406: R29.2 V17.C 27.94,69.85 v63.5,69.85 V15.C
N$20  (via drill 0.7 pad 1.4)
  Top 0.406: v185.42,81.28 H18.C
  Bottom 0.406: D13.9 188.88,77.83 v185.42,81.28
N$21  (via drill 0.7 pad 1.4)
  Top 0.406: v187.96,81.28 H19.C
  Bottom 0.406: D13.10 190.76,78.47 v187.96,81.28
N$22  (via drill 0.7 pad 1.4)
  Top 0.406: v190.5,81.28 H20.C
  Bottom 0.406: v190.5,81.28 192.66,79.12 D13.11
N$23  (via drill 0.7 pad 1.4)
  Top 0.406: v193.04,81.28 H21.C
  Bottom 0.406: v193.04,81.28 194.54,79.78 D13.12
N$24
  Bottom 0.406: R47.2 223.52,72.39 222.63,73.28 D13.23
N$25  (via drill 0.7 pad 1.4)
  Top 0.406: v195.58,81.28 H22.C
  Bottom 0.406: D13.13 219.94,79.78 218.44,81.28 v195.58,81.28
N$26  (via drill 0.7 pad 1.4)
  Top 0.406: v198.12,82.55 H23.C
  Bottom 0.406: D13.14 222.63,79.12 223.52,80.01 223.52,81.28 222.25,82.55 v198.12,82.55
N$27  (via drill 0.7 pad 1.4)
  Top 0.406: v200.66,83.82 H24.C
  Bottom 0.406: D13.15 223.25,78.47 224.79,80.01 224.79,81.28 222.25,83.82 v200.66,83.82
N$28  (via drill 0.7 pad 1.4)
  Top 0.406: H25.C v203.2,85.09
  Bottom 0.406: v203.2,85.09 222.25,85.09 226.06,81.28 226.06,80.01 223.88,77.83 D13.16
N$29  (via drill 0.7 pad 1.4)
  Top 0.406: H26.C 210.34,83.82 v226.06,83.82
  Bottom 0.406: D13.17 224.5,77.17 227.33,80.01 227.33,82.55 v226.06,83.82
N$30  (via drill 0.7 pad 1.4)
  Top 0.406: H27.C 211.61,82.55 v228.6,82.55
  Bottom 0.406: D13.18 225.12,76.53 228.6,80.01 v228.6,82.55
N$31  (via drill 0.7 pad 1.4)
  Top 0.406: H28.C 212.88,81.28 v229.87,81.28
  Bottom 0.406: D13.19 225.74,75.88 229.87,80.01 v229.87,81.28
N$32  (via drill 0.7 pad 1.4)
  Top 0.406: v231.14,80.01 230.98,79.85 214.17,79.85 213.54,79.22 H29.C
  Bottom 0.406: D13.20 226.35,75.22 v231.14,80.01
N$33  (via drill 0.7 pad 1.4)
  Top 0.406: v182.88,45.72 182.88,50.8 H13.G | H11.G 201.93,52.07 v201.93,45.72 | H12.G 191.77,52.07 v191.77,45.72
  Bottom 0.406: v182.88,45.72 v191.77,45.72 v201.93,45.72 211.14,45.72 R36.1
N$34  (via drill 0.7 pad 1.4)
  Top 0.406: V18.C 83.82,74.93 v78.74,74.93
  Bottom 0.406: R32.2 V21.C 26.67,68.58 72.39,68.58 v78.74,74.93 | D10.3 101.6,71.12 87.63,71.12 V18.C
N$35
  Bottom 0.406: H13.F 184.15,55.88 185.42,57.15 190.5,57.15 | 190.5,57.15 H12.F | 190.5,57.15 200.66,57.15 | 200.66,57.15 H11.F | R37.1 200.66,57.15
N$36
  Bottom 0.406: H13.A 189.23,59.69 198.12,59.69 | 198.12,59.69 208.28,59.69 | H12.A 198.12,59.69 | H11.A 208.28,59.69 | R42.1 208.28,59.69
N$37
  Bottom 0.406: H13.B 189.23,54.61 198.12,54.61 | 198.12,54.61 208.28,54.61 | H12.B 198.12,54.61 | H11.B 208.28,54.61 | R41.1 208.28,54.61
N$38
  Top 0.406: D15.5 159.04,40.34 154.94,44.45 22.86,44.45 H30.K
N$39
  Top 0.406: D15.6 158.43,39.7 154.94,43.18 41.91,43.18 H31.K
N$40
  Top 0.406: D15.7 157.81,39.05 154.94,41.91 60.96,41.91 H32.K
N$41
  Top 0.406: D15.8 157.19,38.4 154.94,40.64 80.01,40.64 H33.K
N$42
  Top 0.406: D15.9 156.56,37.74 154.94,39.37 99.06,39.37 H34.K
N$43
  Top 0.406: D15.10 155.94,37.09 154.94,38.1 118.11,38.1 H35.K
N$44
  Top 0.406: D15.11 155.32,36.45 154.94,36.83 137.16,36.83 H36.K
N$45
  Top 0.406: H37.K 156.44,35.8 D15.12
N$46  (via drill 0.7 pad 1.4)
  Top 0.406: D15.13 168.03,29.59 v167.64,29.21
  Bottom 0.406: v167.64,29.21 162.56,29.21 156.21,35.56 22.86,35.56 H38.K
N$47  (via drill 0.7 pad 1.4)
  Top 0.406: D15.14 168.01,36.43 167.13,36.43 166.37,35.66 v166.37,30.48
  Bottom 0.406: v166.37,30.48 162.56,30.48 156.21,36.83 41.91,36.83 H39.K
N$48  (via drill 0.7 pad 1.4)
  Top 0.406: v165.1,31.75 165.1,35.56 166.63,37.09 D15.15
  Bottom 0.406: v165.1,31.75 162.56,31.75 156.21,38.1 60.96,38.1 H40.K
N$49  (via drill 0.7 pad 1.4)
  Top 0.406: v163.83,33.02 163.83,35.56 166.01,37.74 D15.16
  Bottom 0.406: v163.83,33.02 162.56,33.02 156.21,39.37 80.01,39.37 H41.K
N$50  (via drill 0.7 pad 1.4)
  Top 0.406: D15.17 168.9,38.4 170.18,37.12 v170.18,33.02
  Bottom 0.406: v170.18,33.02 166.37,33.02 165.1,34.29 162.56,34.29 156.21,40.64 99.06,40.64 H42.K
N$51  (via drill 0.7 pad 1.4)
  Top 0.406: v171.45,34.29 171.45,36.83 169.24,39.05 D15.18
  Bottom 0.406: v171.45,34.29 166.37,34.29 165.1,35.56 162.56,35.56 156.21,41.91 118.11,41.91 H43.K
N$52  (via drill 0.7 pad 1.4)
  Top 0.406: D15.19 169.85,39.7 172.72,36.83 v172.72,35.56
  Bottom 0.406: v172.72,35.56 166.37,35.56 165.1,36.83 162.56,36.83 156.21,43.18 137.16,43.18 H44.K
N$53  (via drill 0.7 pad 1.4)
  Top 0.406: v173.99,36.83 170.47,40.34 D15.20
  Bottom 0.406: v173.99,36.83 166.37,36.83 165.1,38.1 162.56,38.1 H45.K
N$54
  Top 0.406: D15.23 172.16,42.3 R49.2
N$55
  Top 0.406: H11.CC1 207.01,52.07 207.01,49.53 H11.CC2 V26.3
N$56
  Bottom 0.406: H13.D 184.15,48.26 185.42,46.99 190.5,46.99 | 190.5,46.99 200.66,46.99 | H11.D 200.66,46.99 | H12.D 190.5,46.99 | 200.66,46.99 R39.1
N$57
  Top 0.406: H6.1 201.93,36.83 H4.4
N$58
  Top 0.406: R7.2 173.67,73.66 171.61,75.72 H1.C
N$59
  Top 0.406: H6.4 209.55,29.21 H8.1
N$60
  Top 0.406: R7.1 171.62,72.24 V1.3
N$61  (via drill 0.7 pad 1.4)
  Top 0.406: D15.4 159.66,40.99 157.8,42.86 D16.4 156.5,46.99 v156.21,46.99
  Bottom 0.406: R48.1 156.21,48.58 v156.21,46.99
N$62  (via drill 0.7 pad 1.4)
  Top 0.406: v170.18,49.53 171.45,50.8 D4.2
  Bottom 0.406: D2.3 v170.18,49.53
N$63
  Top 0.406: H10.1 209.55,13.97 H8.4
N$64
  Top 0.406: H12.CC1 196.85,52.07 196.85,49.53 H12.CC2 V27.3
N$65
  Top 0.406: H13.CC1 186.69,52.07 186.69,48.26 | V28.3 186.69,48.26 | H13.CC2 186.69,48.26
N$66  (via drill 0.7 pad 1.4)
  Top 0.406: v218.44,77.47 219.39,78.42 R46.1
  Bottom 0.406: v218.44,77.47 218.44,76.2 216.81,74.58 D13.4 208.28,74.58 D14.4
N$68
  Top 0.406: H3.4 186.69,6.35 H5.1
N$70
  Top 0.406: H7.1 179.07,13.97 H5.4
N$73
  Top 0.406: H7.4 179.07,29.21 H9.1
N$78  (via drill 0.7 pad 1.4)
  Top 0.406: H11.C 207.01,54.61 v207.01,60.96 199.39,60.96 | H13.C 189.23,54.61 189.23,59.69 190.5,60.96 199.39,60.96 | H12.C 199.39,54.61 199.39,60.96
  Bottom 0.406: v207.01,60.96 208.28,62.23 R40.1
N$80
  Bottom 0.406: H13.E 184.15,50.8 185.42,52.07 190.5,52.07 | 190.5,52.07 H12.E | 190.5,52.07 200.66,52.07 | 200.66,52.07 H11.E | R38.1 200.66,52.07
PAUSE_CNT  (via drill 0.7 pad 1.4)
  Top 0.406: S12.3 157.76,54.61 v165.1,54.61
  Bottom 0.406: S12.3 154.62,57.75 R14.2 | v165.1,54.61 165.5,54.61 166.37,55.48 D2.13
PL_DIN
  Bottom 0.406: D12.2 203.2,10.16 208.28,15.24 219.71,15.24 220.98,13.97 246.38,13.97 X1.15
PS_BPM  (via drill 0.7 pad 1.4)
  Top 0.406: v215.9,67.31 237.64,67.31 243.84,61.11 243.84,41.91 X1.6
  Bottom 0.406: D6.5 157.48,69.85 158.75,68.58 171.45,68.58 173.35,66.67 178.44,66.67 179.71,67.94 205.1,67.94 205.74,67.31 v215.9,67.31
PS_GATE  (via drill 0.7 pad 1.4)
  Top 0.406: v217.17,68.58 237.49,68.58 245.11,60.96 245.11,43.18 X1.5
  Bottom 0.406: D11.5 171.45,69.85 173.35,67.94 178.44,67.94 179.71,69.22 205.1,69.22 205.74,68.58 v217.17,68.58
Q0
  Top 0.406: D6.3 144.15,61.59 D7.3
  Bottom 0.406: D6.3 148.59,66.04 156.21,66.04 158.75,63.5 166.37,63.5 D11.3
Q0_SW_BD
  Bottom 0.406: V21.A V17.A V25.A 28.93,81.28 S2.3
Q0_SW_GD
  Bottom 0.406: V13.A V5.A V9.A 28.93,55.88 S7.4
Q1
  Top 0.406: D7.2 145.41,60.33 D6.2
  Bottom 0.406: D6.2 148.59,62.23 149.86,60.96 162.56,60.96 163.83,62.23 D11.2
Q1_SW_BD
  Bottom 0.406: V24.A V20.A V16.A 49.25,81.28 S3.3
Q1_SW_GD
  Bottom 0.406: V4.A V8.A V12.A 49.25,55.88 S8.4
Q2  (via drill 0.7 pad 1.4)
  Top 0.406: v140.97,57.15 140.34,56.52 D7.6 | D6.1 148.59,60.96 161.29,60.96 162.56,59.69 D11.1
  Bottom 0.406: D6.1 144.78,57.15 v140.97,57.15
Q2_SW_BD
  Bottom 0.406: S4.3 69.57,81.28 V15.A V23.A V19.A
Q2_SW_GD
  Bottom 0.406: S9.4 69.57,55.88 V3.A V11.A V7.A
Q3
  Top 0.406: D7.7 139.06,56.52 137.16,58.42 137.16,59.69 D6.15
  Bottom 0.406: D11.15 158.75,62.23 156.21,64.77 149.86,64.77 148.59,63.5 142.24,63.5 140.97,62.23 D6.15
Q3_SW_BD
  Bottom 0.406: S5.3 89.89,81.28 V22.A V18.A V14.A
Q3_SW_GD
  Bottom 0.406: V6.A V10.A V2.A 89.89,55.88 S10.4
RESET_CNT  (via drill 0.7 pad 1.4)
  Top 0.406: S14.3 131.09,80.57 132.92,78.74 161.29,78.74 162.56,77.47 162.56,63.5 v165.1,60.96
  Bottom 0.406: R15.2 131.09,78.78 S14.3 | v165.1,60.96 D2.12
SCK  (via drill 0.7 pad 1.4)
  Top 0.406: D3.1 238.76,46.99 234.95,43.18 v231.14,43.18 | D5.16 171.85,18.18 v172.72,19.05 | D15.3 164.84,41.65 v165.1,41.91 v165.1,39.37
  Bottom 0.406: 175.26,26.67 172.72,24.13 v172.72,19.05 | 175.26,26.67 218.44,26.67 X1.30 231.14,39.37 v231.14,43.18 231.14,59.69 219.71,71.12 219.71,72.39 218.18,73.92 D13.3 | 175.26,26.67 175.26,38.1 173.99,39.37 v165.1,39.37 | D2.1 172.72,45.72 168.91,41.91 v165.1,41.91
SRC_BPM  (via drill 0.7 pad 1.4)
  Top 0.406: D7.4 142.88,62.87 D6.4 | D9.5 124.46,68.58 124.46,63.5 D9.1 | D10.1 101.6,71.12 106.68,71.12 D10.5 | v217.17,66.04 237.49,66.04 242.57,60.96 242.57,40.64 X1.7
  Bottom 0.406: D8.1 101.6,58.42 106.68,58.42 D8.5 111.76,53.34 119.38,53.34 D9.1 132.08,66.04 146.05,66.04 D6.4 157.48,67.31 158.75,66.04 166.37,66.04 D11.4 170.81,67.31 172.72,65.41 178.44,65.41 179.71,66.67 205.1,66.67 205.74,66.04 v217.17,66.04 | D9.5 125.73,72.39 118.11,72.39 116.84,71.12 111.76,71.12 D10.5
SRC_SW_BD  (via drill 0.7 pad 1.4)
  Top 0.406: v92.71,76.2 13.69,76.2 S1.3 | v121.97,73.61 120.74,72.39 116.84,72.39 115.57,71.12 114.3,71.12 D10.6
  Bottom 0.406: D10.6 109.22,76.2 101.6,76.2 | D10.2 101.6,76.2 | 101.6,76.2 v92.71,76.2 | v121.97,73.61 121.92,73.66 D9.6 | R28.1 9.17,80.68 S1.3
SRC_SW_GD
  Top 0.406: S6.3 12.42,59.69 77.47,59.69 78.74,58.42 99.06,58.42 D8.2 104.14,53.34 109.22,53.34 D8.6
  Bottom 0.406: D8.6 114.3,58.42 121.92,58.42 D9.2 | R21.1 9.17,62.9 S6.3
STP_LE_K
  Bottom 0.406: D1.13 194.94,73.03 D14.2
STP_LE_S  (via drill 0.7 pad 1.4)
  Top 0.406: v177.8,73.66 176.53,72.39 176.53,63.5 166.37,53.34 160.02,53.34 158.75,52.07 D16.2
  Bottom 0.406: v177.8,73.66 187.96,73.66 D1.14